# Altium schematic sheet Sheet1_Drone.SchDoc
size A4
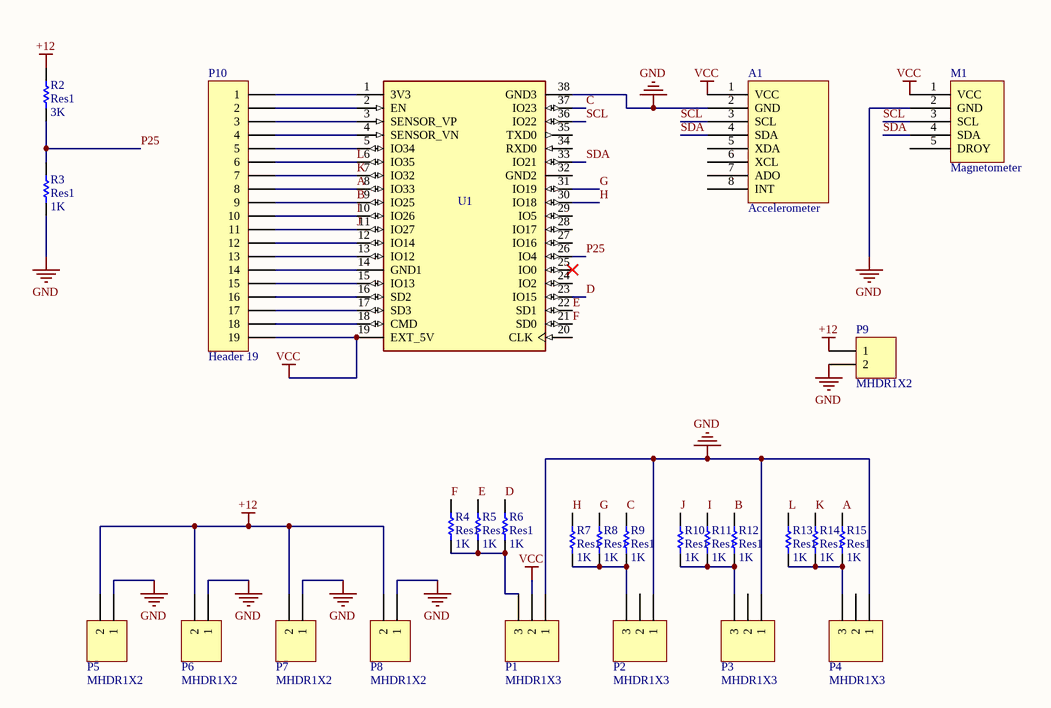
[diagram p0: Sheet1_Drone.SchDoc]

## Parts
A1  Accelerometer  [Accelerometer]
M1  Magnetometer  [Magnetometer]
P1  MHDR1X3  [SAMTEC_BBS-102-X-X]
P2  MHDR1X3  [SAMTEC_BBS-102-X-X]
P3  MHDR1X3  [SAMTEC_BBS-102-X-X]
P4  MHDR1X3  [SAMTEC_BBS-102-X-X]
P5  MHDR1X2  [XT30UPB-M]
P6  MHDR1X2  [XT30UPB-M]
P7  MHDR1X2  [XT30UPB-M]
P8  MHDR1X2  [XT30UPB-M]
P9  MHDR1X2  [AMASS_XT60-M]
P10  Header 19  [HDR1X19]
R2  Res1  value 3K  [res]
R3  Res1  value 1K  [res]
R4  Res1  value 1K  [res]
R5  Res1  value 1K  [res]
R6  Res1  value 1K  [res]
R7  Res1  value 1K  [res]
R8  Res1  value 1K  [res]
R9  Res1  value 1K  [res]
R10  Res1  value 1K  [res]
R11  Res1  value 1K  [res]
R12  Res1  value 1K  [res]
R13  Res1  value 1K  [res]
R14  Res1  value 1K  [res]
R15  Res1  value 1K  [res]
U1  (no value)  [MODULE_ESP32-DEVKITC]

## Nets
+12: P5.2 P6.2 P7.2 P8.2 P9.1 R2.1
GND: A1.2(GND) M1.2(GND) P1.1 P2.1 P3.1 P4.1 P5.1 P6.1 P7.1 P8.1 P9.2 R3.2 U1.38(GND3)
VCC: A1.1(VCC) M1.1(VCC) P1.2 P10.19 U1.19(EXT_5V)
A: P10.8 R15.1 U1.8(IO33)
B: P10.9 R12.1 U1.9(IO25)
C: R9.1 U1.37(IO23)
D: R6.1 U1.23(IO15)
E: R5.2 U1.22(SD1)
F: R4.1 U1.21(SD0)
G : R8.2 U1.31(IO19)
H: R7.1 U1.30(IO18)
I: P10.10 R11.2 U1.10(IO26)
J: P10.11 R10.1 U1.11(IO27)
K: P10.7 R14.2 U1.7(IO32)
L: P10.6 R13.1 U1.6(IO35)
P25: R2.2 R3.1 U1.26(IO4)
SCL: A1.3(SCL) M1.3(SCL) U1.36(IO22)
SDA: A1.4(SDA) M1.4(SDA) U1.33(IO21)
NetP1_3: P1.3 R4.2 R5.1 R6.2
NetP2_3: P2.3 R7.2 R8.1 R9.2
NetP3_3: P3.3 R10.2 R11.1 R12.2
NetP4_3: P4.3 R13.2 R14.1 R15.2
NetP10_1: P10.1 U1.1(3V3)
NetP10_2: P10.2 U1.2(EN)
NetP10_3: P10.3 U1.3(SENSOR_VP)
NetP10_4: P10.4 U1.4(SENSOR_VN)
NetP10_5: P10.5 U1.5(IO34)
NetP10_12: P10.12 U1.12(IO14)
NetP10_13: P10.13 U1.13(IO12)
NetP10_14: P10.14 U1.14(GND1)
NetP10_15: P10.15 U1.15(IO13)
NetP10_16: P10.16 U1.16(SD2)
NetP10_17: P10.17 U1.17(SD3)
NetP10_18: P10.18 U1.18(CMD)

Not connected (* = marked no-connect by the designer): A1 5(XDA) 6(XCL) 7(ADO) 8(INT); M1 5(DROY); P2 2; P3 2; P4 2; U1 20(CLK) 24(IO2) 25(IO0)* 27(IO16) 28(IO17) 29(IO5) 32(GND2) 34(RXD0) 35(TXD0)

## Library data of the parts
A1 = HW123_Accelerator
P1-P4 = MHDR1X3: Header, 3-Pin; LatestRevisionDate: 17-Jul-2002; LatestRevisionNote: Re-released for DXP Platform.; Publisher: Altium Limited
P5-P9 = MHDR1X2: Header, 2-Pin; LatestRevisionDate: 17-Jul-2002; LatestRevisionNote: Re-released for DXP Platform.; Publisher: Altium Limited
P10 = Header 19: Header, 19-Pin; LatestRevisionDate: 17-Jul-2002; LatestRevisionNote: Re-released for DXP Platform.; Publisher: Altium Limited
R2-R15 = Res1: Resistor; Published: 8-Jun-2000; LatestRevisionDate: 17-Jul-2002; LatestRevisionNote: Re-released for DXP Platform.; PackageReference: AXIAL-0.3; Publisher: Altium Limited; PackageDescription: Axial Device, Thru-Hole; 2 Leads; 0.3 in Pin Spacing
U1 = ESP32-DEVKITC: - Transceiver; 802.11 b/g/n _Wi-Fi, WiFi, WLAN_, BluetoothÂ® Smart Ready 4.x Dual Mode For Use With ESP-WROOM-32; MP: ESP32-DEVKITC-32D-F; MF: Espressif Systems; Price: None; SnapEDA_Link: https://www.snapeda.com/parts/ESP32-DEVKITC-32D-F/Espressif%20Systems/view-part/4220172/?ref=snap; Availability: Unavailable; Value: *; Package: None